# Altium project PCB_Project.PrjPcb (part 2 of 10)
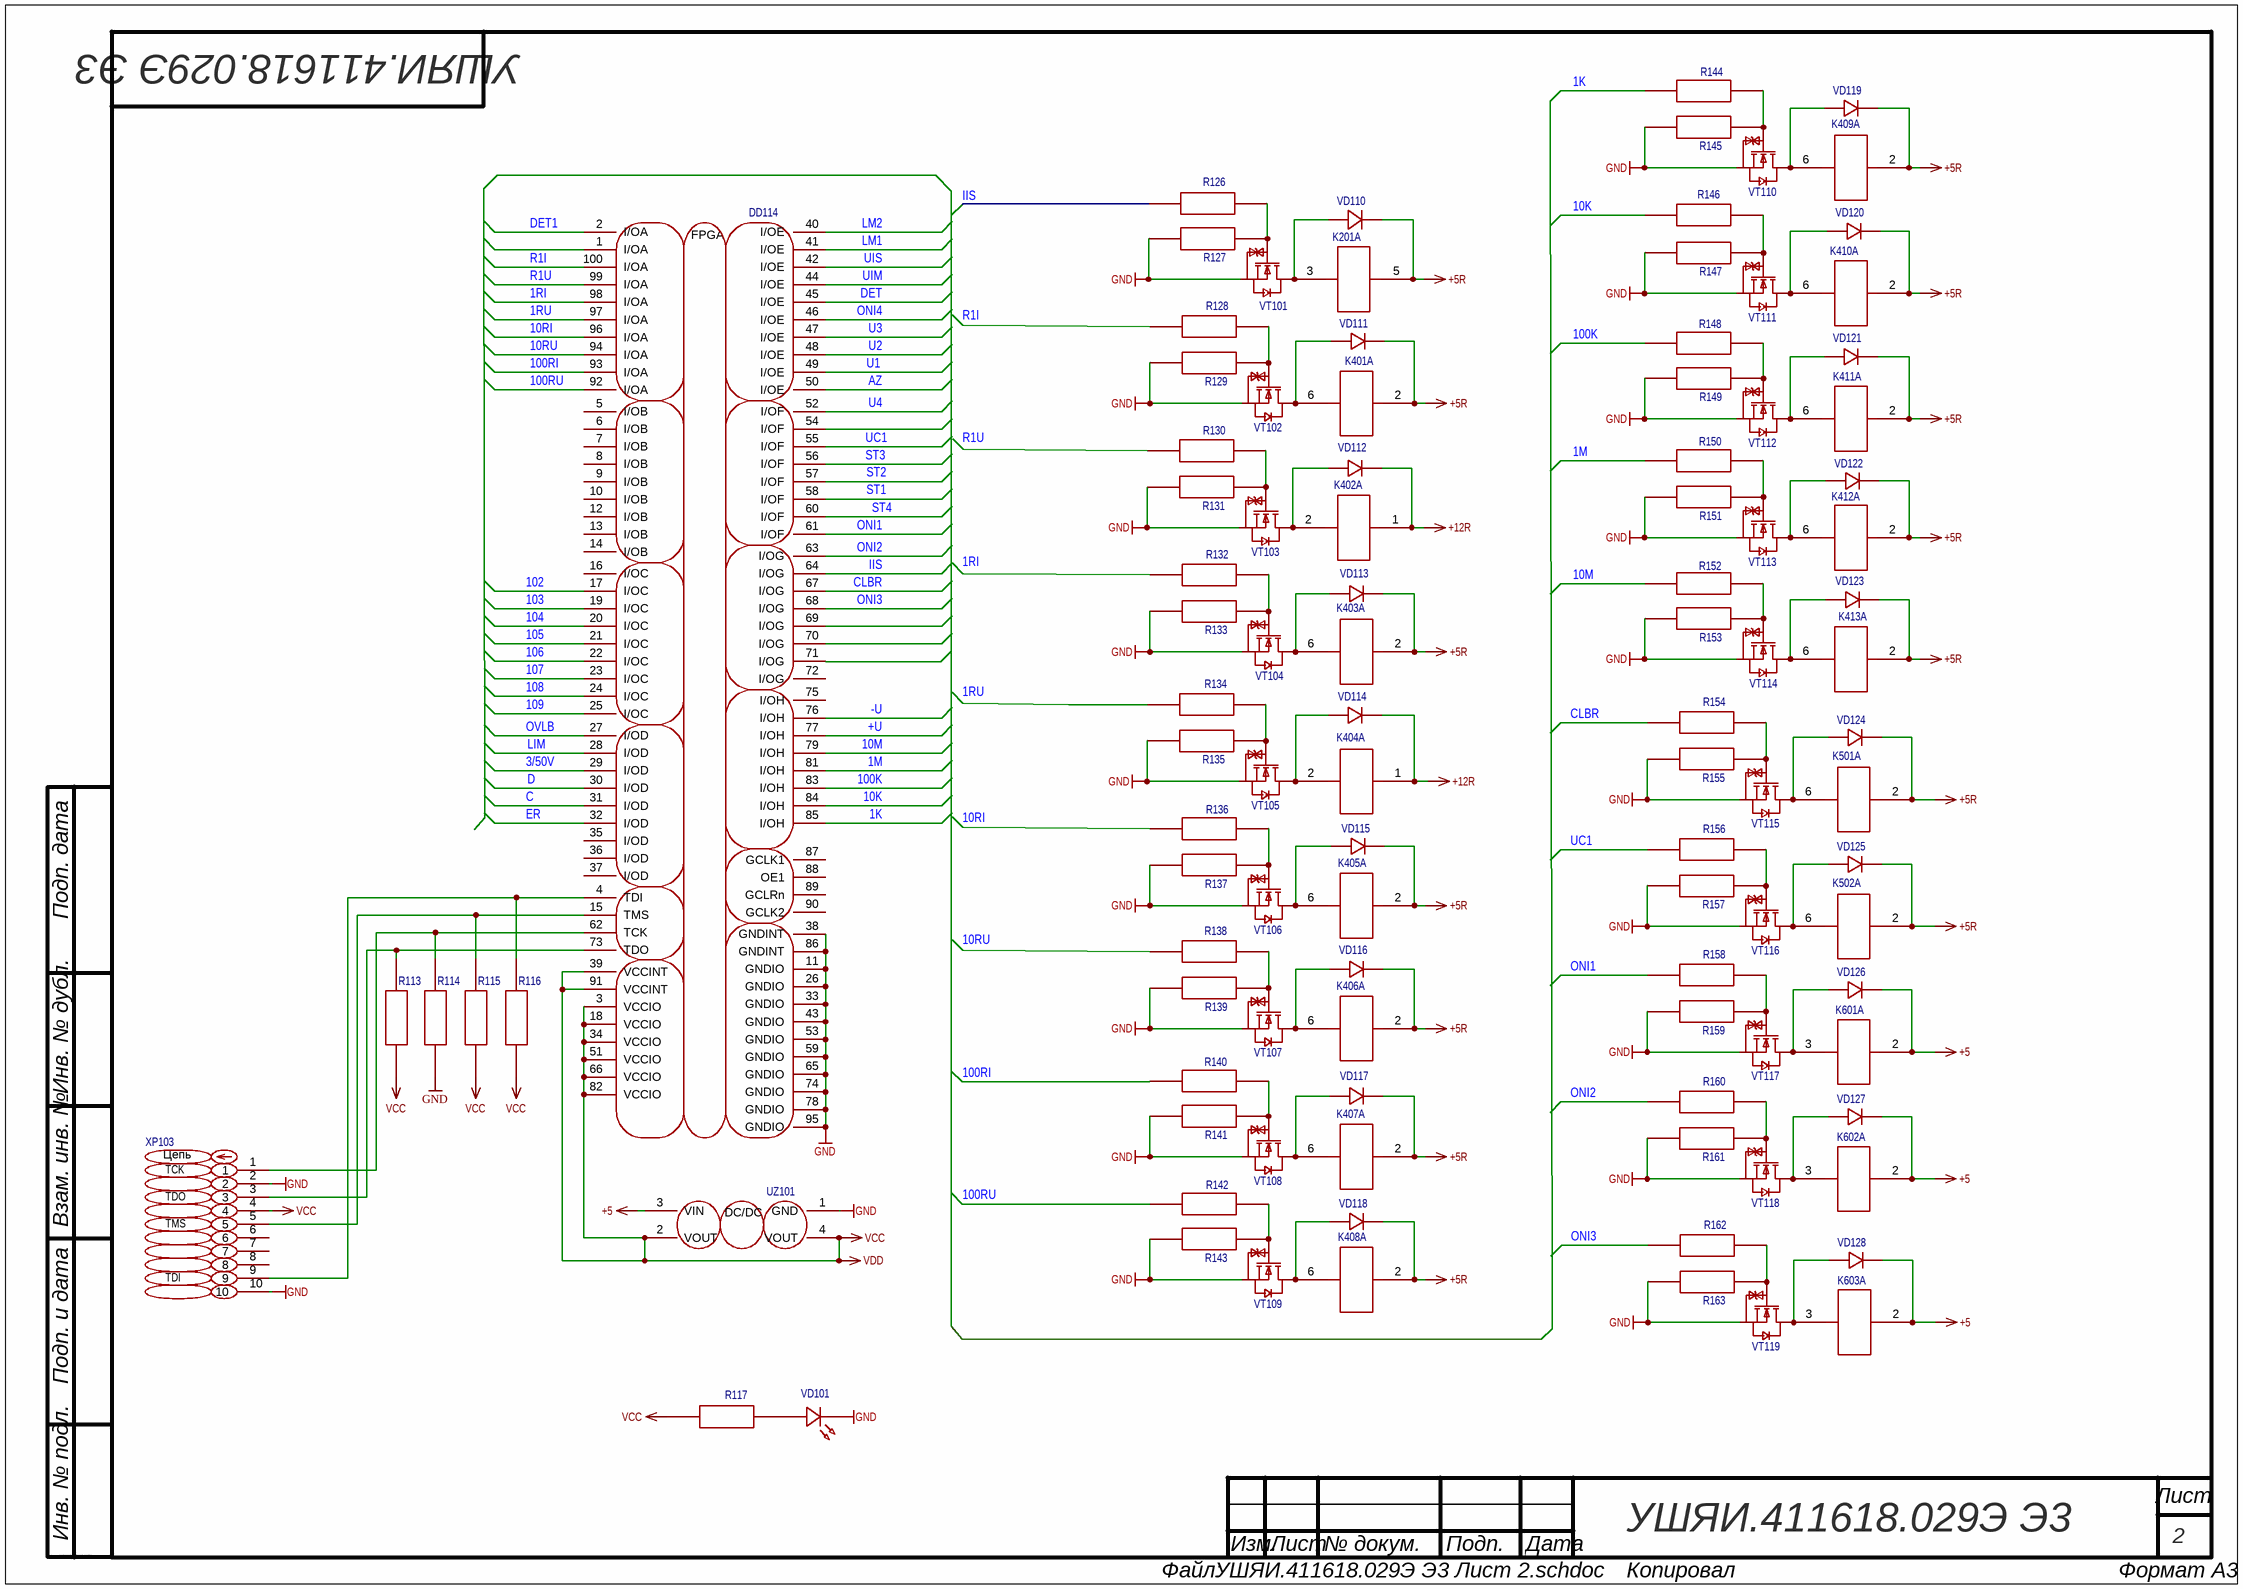
[diagram p7: УШЯИ.411618.029Э Э3 Лист 2.schdoc]

## Sheet УШЯИ.411618.029Э Э3 Лист 2.schdoc (continued)

### Parts
(Parts that share a designator on the sheet are numbered #1, #2 ... from top to bottom, then left to right.)
DD114  ПЛИС EPM3128ATC100-10N [TQFP-100]  [TQFP-100_L14.0-W14.0-P0.50-LS16.0-BL]  (value not drawn)
K201#1  Реле герконовое SIL05-1A72-71L [PCB]  [Реле герконовое DIP05-1C90-51L [PCB]]  (value not drawn)  (part A of 2)
K401  Реле герконовое DIP05-1A72-13L  [PCB]  [RELAY-TH_STANDEXMEDER_DIP05-1A72-13L]  (value not drawn)  (part A of 2)
K402  Реле герконовое УШЯИ.685442.092 (2 реле)  (value not drawn)  (part A of 2)
K403  Реле герконовое DIP05-1A72-13L  [PCB]  [RELAY-TH_STANDEXMEDER_DIP05-1A72-13L]  (value not drawn)  (part A of 2)
K404  Реле герконовое УШЯИ.685442.092 (1 реле)  (value not drawn)  (part A of 2)
K405  Реле герконовое DIP05-1A72-13L  [PCB]  [RELAY-TH_STANDEXMEDER_DIP05-1A72-13L]  (value not drawn)  (part A of 2)
K406  Реле герконовое DIP05-1A72-13L  [PCB]  [RELAY-TH_STANDEXMEDER_DIP05-1A72-13L]  (value not drawn)  (part A of 2)
K407  Реле герконовое DIP05-1A72-13L  [PCB]  [RELAY-TH_STANDEXMEDER_DIP05-1A72-13L]  (value not drawn)  (part A of 2)
K408  Реле герконовое DIP05-1A72-13L  [PCB]  [RELAY-TH_STANDEXMEDER_DIP05-1A72-13L]  (value not drawn)  (part A of 2)
K409  Реле герконовое DIP05-1A72-13L  [PCB]  [RELAY-TH_STANDEXMEDER_DIP05-1A72-13L]  (value not drawn)  (part A of 2)
K410  Реле герконовое DIP05-1A72-13L  [PCB]  [RELAY-TH_STANDEXMEDER_DIP05-1A72-13L]  (value not drawn)  (part A of 2)
K411  Реле герконовое DIP05-1A72-13L  [PCB]  [RELAY-TH_STANDEXMEDER_DIP05-1A72-13L]  (value not drawn)  (part A of 2)
K412  Реле герконовое DIP05-1A72-13L  [PCB]  [RELAY-TH_STANDEXMEDER_DIP05-1A72-13L]  (value not drawn)  (part A of 2)
K413  Реле герконовое DIP05-1A72-13L  [PCB]  [RELAY-TH_STANDEXMEDER_DIP05-1A72-13L]  (value not drawn)  (part A of 2)
K501  Реле герконовое DIP05-1A72-13L  [PCB]  [RELAY-TH_STANDEXMEDER_DIP05-1A72-13L]  (value not drawn)  (part A of 2)
K502  Реле герконовое DIP05-1A72-13L  [PCB]  [RELAY-TH_STANDEXMEDER_DIP05-1A72-13L]  (value not drawn)  (part A of 2)
K601#1  Реле герконовое DIP05-1C90-51L [PCB]  [Реле герконовое DIP05-1A72-13L  [PCB]]  (value not drawn)  (part A of 2)
K602#1  Реле герконовое DIP05-1C90-51L [PCB]  [Реле герконовое DIP05-1A72-13L  [PCB]]  (value not drawn)  (part A of 2)
K603  Реле герконовое DIP05-1C90-51L [PCB]  [Реле герконовое DIP05-1C90-51L [PCB]]  (value not drawn)  (part A of 2)
R113  Резистор 1кОм 0,125Вт 1% [0805]  [R0805]  (value not drawn)
R114  Резистор 1кОм 0,125Вт 1% [0805]  [R0805]  (value not drawn)
R115  Резистор 1кОм 0,125Вт 1% [0805]  [R0805]  (value not drawn)
R116  Резистор 1кОм 0,125Вт 1% [0805]  [R0805]  (value not drawn)
R117  Резистор 100Ом 0,125Вт 1% [0805]  [R0805]  (value not drawn)
R126  Резистор 100Ом 0,125Вт 1% [0805]  [R0805]  (value not drawn)
R127  Резистор 100Ом 0,125Вт 1% [0805]  [R0805]  (value not drawn)
R128  Резистор 100Ом 0,125Вт 1% [0805]  [R0805]  (value not drawn)
R129  Резистор 100Ом 0,125Вт 1% [0805]  [R0805]  (value not drawn)
R130  Резистор 100Ом 0,125Вт 1% [0805]  [R0805]  (value not drawn)
R131  Резистор 100Ом 0,125Вт 1% [0805]  [R0805]  (value not drawn)
R132  Резистор 100Ом 0,125Вт 1% [0805]  [R0805]  (value not drawn)
R133  Резистор 100Ом 0,125Вт 1% [0805]  [R0805]  (value not drawn)
R134  Резистор 100Ом 0,125Вт 1% [0805]  [R0805]  (value not drawn)
R135  Резистор 100Ом 0,125Вт 1% [0805]  [R0805]  (value not drawn)
R136  Резистор 100Ом 0,125Вт 1% [0805]  [R0805]  (value not drawn)
R137  Резистор 100Ом 0,125Вт 1% [0805]  [R0805]  (value not drawn)
R138  Резистор 100Ом 0,125Вт 1% [0805]  [R0805]  (value not drawn)
R139  Резистор 100Ом 0,125Вт 1% [0805]  [R0805]  (value not drawn)
R140  Резистор 100Ом 0,125Вт 1% [0805]  [R0805]  (value not drawn)
R141  Резистор 100Ом 0,125Вт 1% [0805]  [R0805]  (value not drawn)
R142  Резистор 100Ом 0,125Вт 1% [0805]  [R0805]  (value not drawn)
R143  Резистор 100Ом 0,125Вт 1% [0805]  [R0805]  (value not drawn)
R144  Резистор 100Ом 0,125Вт 1% [0805]  [R0805]  (value not drawn)
R145  Резистор 100Ом 0,125Вт 1% [0805]  [R0805]  (value not drawn)
R146  Резистор 100Ом 0,125Вт 1% [0805]  [R0805]  (value not drawn)
R147  Резистор 100Ом 0,125Вт 1% [0805]  [R0805]  (value not drawn)
R148  Резистор 100Ом 0,125Вт 1% [0805]  [R0805]  (value not drawn)
R149  Резистор 100Ом 0,125Вт 1% [0805]  [R0805]  (value not drawn)
R150  Резистор 100Ом 0,125Вт 1% [0805]  [R0805]  (value not drawn)
R151  Резистор 100Ом 0,125Вт 1% [0805]  [R0805]  (value not drawn)
R152  Резистор 100Ом 0,125Вт 1% [0805]  [R0805]  (value not drawn)
R153  Резистор 100Ом 0,125Вт 1% [0805]  [R0805]  (value not drawn)
R154  Резистор 100Ом 0,125Вт 1% [0805]  [R0805]  (value not drawn)
R155  Резистор 100Ом 0,125Вт 1% [0805]  [R0805]  (value not drawn)
R156  Резистор 100Ом 0,125Вт 1% [0805]  [R0805]  (value not drawn)
R157  Резистор 100Ом 0,125Вт 1% [0805]  [R0805]  (value not drawn)
R158  Резистор 100Ом 0,125Вт 1% [0805]  [R0805]  (value not drawn)
R159  Резистор 100Ом 0,125Вт 1% [0805]  [R0805]  (value not drawn)
R160  Резистор 100Ом 0,125Вт 1% [0805]  [R0805]  (value not drawn)
R161  Резистор 100Ом 0,125Вт 1% [0805]  [R0805]  (value not drawn)
R162  Резистор 100Ом 0,125Вт 1% [0805]  [R0805]  (value not drawn)
R163  Резистор 100Ом 0,125Вт 1% [0805]  [R0805]  (value not drawn)
UZ101  Линейный регулятор напряжения LM1117GS-3.3 [SOT-223]  [SOT-223-3_L6.5-W3.4-P2.30-LS7.0-BR]  (value not drawn)
VD101  Светодиод YLED0805YG [0805]  [LED0805-R-RD]  (value not drawn)
VD110  Диод импульсный 1N4448 [SOD-123]  [SOD-123_L2.7-W1.6-LS3.7-RD-1]  (value not drawn)
VD111  Диод импульсный 1N4448 [DO-35]  [DO-35_BD2.0-L4.2-P8.20-D0.5-RD]  (value not drawn)
VD112  Диод импульсный 1N4448 [DO-35]  [DO-35_BD2.0-L4.2-P8.20-D0.5-RD]  (value not drawn)
VD113  Диод импульсный 1N4448 [DO-35]  [DO-35_BD2.0-L4.2-P8.20-D0.5-RD]  (value not drawn)
VD114  Диод импульсный 1N4448 [DO-35]  [DO-35_BD2.0-L4.2-P8.20-D0.5-RD]  (value not drawn)
VD115  Диод импульсный 1N4448 [DO-35]  [DO-35_BD2.0-L4.2-P8.20-D0.5-RD]  (value not drawn)
VD116  Диод импульсный 1N4448 [DO-35]  [DO-35_BD2.0-L4.2-P8.20-D0.5-RD]  (value not drawn)
VD117  Диод импульсный 1N4448 [DO-35]  [DO-35_BD2.0-L4.2-P8.20-D0.5-RD]  (value not drawn)
VD118  Диод импульсный 1N4448 [DO-35]  [DO-35_BD2.0-L4.2-P8.20-D0.5-RD]  (value not drawn)
VD119  Диод импульсный 1N4448 [DO-35]  [DO-35_BD2.0-L4.2-P8.20-D0.5-RD]  (value not drawn)
VD120  Диод импульсный 1N4448 [DO-35]  [DO-35_BD2.0-L4.2-P8.20-D0.5-RD]  (value not drawn)
VD121  Диод импульсный 1N4448 [DO-35]  [DO-35_BD2.0-L4.2-P8.20-D0.5-RD]  (value not drawn)
VD122  Диод импульсный 1N4448 [DO-35]  [DO-35_BD2.0-L4.2-P8.20-D0.5-RD]  (value not drawn)
VD123  Диод импульсный 1N4448 [DO-35]  [DO-35_BD2.0-L4.2-P8.20-D0.5-RD]  (value not drawn)
VD124  Диод импульсный 1N4448 [DO-35]  [DO-35_BD2.0-L4.2-P8.20-D0.5-RD]  (value not drawn)
VD125  Диод импульсный 1N4448 [DO-35]  [DO-35_BD2.0-L4.2-P8.20-D0.5-RD]  (value not drawn)
VD126  Диод импульсный 1N4448 [DO-35]  [DO-35_BD2.0-L4.2-P8.20-D0.5-RD]  (value not drawn)
VD127  Диод импульсный 1N4448 [DO-35]  [DO-35_BD2.0-L4.2-P8.20-D0.5-RD]  (value not drawn)
VD128  Диод импульсный 1N4448 [DO-35]  [DO-35_BD2.0-L4.2-P8.20-D0.5-RD]  (value not drawn)
VT101  Транзистор полевой MOSFET N-канальный BSS138BK [SOT-23-3]  [SOT-23-3_L2.9-W1.3-P1.90-LS2.4-BR]  (value not drawn)
VT102  Транзистор полевой MOSFET N-канальный BSS138BK [SOT-23-3]  [SOT-23-3_L2.9-W1.3-P1.90-LS2.4-BR]  (value not drawn)
VT103  Транзистор полевой MOSFET N-канальный BSS138BK [SOT-23-3]  [SOT-23-3_L2.9-W1.3-P1.90-LS2.4-BR]  (value not drawn)
VT104  Транзистор полевой MOSFET N-канальный BSS138BK [SOT-23-3]  [SOT-23-3_L2.9-W1.3-P1.90-LS2.4-BR]  (value not drawn)
VT105  Транзистор полевой MOSFET N-канальный BSS138BK [SOT-23-3]  [SOT-23-3_L2.9-W1.3-P1.90-LS2.4-BR]  (value not drawn)
VT106  Транзистор полевой MOSFET N-канальный BSS138BK [SOT-23-3]  [SOT-23-3_L2.9-W1.3-P1.90-LS2.4-BR]  (value not drawn)
VT107  Транзистор полевой MOSFET N-канальный BSS138BK [SOT-23-3]  [SOT-23-3_L2.9-W1.3-P1.90-LS2.4-BR]  (value not drawn)
VT108  Транзистор полевой MOSFET N-канальный BSS138BK [SOT-23-3]  [SOT-23-3_L2.9-W1.3-P1.90-LS2.4-BR]  (value not drawn)
VT109  Транзистор полевой MOSFET N-канальный BSS138BK [SOT-23-3]  [SOT-23-3_L2.9-W1.3-P1.90-LS2.4-BR]  (value not drawn)
VT110  Транзистор полевой MOSFET N-канальный BSS138BK [SOT-23-3]  [SOT-23-3_L2.9-W1.3-P1.90-LS2.4-BR]  (value not drawn)
VT111  Транзистор полевой MOSFET N-канальный BSS138BK [SOT-23-3]  [SOT-23-3_L2.9-W1.3-P1.90-LS2.4-BR]  (value not drawn)
VT112  Транзистор полевой MOSFET N-канальный BSS138BK [SOT-23-3]  [SOT-23-3_L2.9-W1.3-P1.90-LS2.4-BR]  (value not drawn)
VT113  Транзистор полевой MOSFET N-канальный BSS138BK [SOT-23-3]  [SOT-23-3_L2.9-W1.3-P1.90-LS2.4-BR]  (value not drawn)
VT114  Транзистор полевой MOSFET N-канальный BSS138BK [SOT-23-3]  [SOT-23-3_L2.9-W1.3-P1.90-LS2.4-BR]  (value not drawn)
VT115  Транзистор полевой MOSFET N-канальный BSS138BK [SOT-23-3]  [SOT-23-3_L2.9-W1.3-P1.90-LS2.4-BR]  (value not drawn)
VT116  Транзистор полевой MOSFET N-канальный BSS138BK [SOT-23-3]  [SOT-23-3_L2.9-W1.3-P1.90-LS2.4-BR]  (value not drawn)
VT117  Транзистор полевой MOSFET N-канальный BSS138BK [SOT-23-3]  [SOT-23-3_L2.9-W1.3-P1.90-LS2.4-BR]  (value not drawn)
VT118  Транзистор полевой MOSFET N-канальный BSS138BK [SOT-23-3]  [SOT-23-3_L2.9-W1.3-P1.90-LS2.4-BR]  (value not drawn)
VT119  Транзистор полевой MOSFET N-канальный BSS138BK [SOT-23-3]  [SOT-23-3_L2.9-W1.3-P1.90-LS2.4-BR]  (value not drawn)
XP103  Вилка на плату прямая BH-10 (DS1013-10S) 10pin шаг 2.54мм  [IDC-TH_10P-P2.54-V-R2-C5-S2.54]  (value not drawn)

### Nets
+5: K601#1.2 K602#1.2 K603.2 UZ101.3(VIN) VD126.1 VD127.1 VD128.1
+5R: K201#1.5 K401.2 K403.2 K405.2 K406.2 K407.2 K408.2 K409.2 K410.2 K411.2 K412.2 K413.2 K501.2 K502.2 VD110.1(C) VD111.1 VD113.1 VD115.1 VD116.1 VD117.1 VD118.1 VD119.1 VD120.1 VD121.1 VD122.1 VD123.1 VD124.1 VD125.1
+12R: K402.1 K404.1 VD112.1 VD114.1
GND: DD114.11(GNDIO) DD114.26(GNDIO) DD114.33(GNDIO) DD114.38(GNDINT) DD114.43(GNDIO) DD114.53(GNDIO) DD114.59(GNDIO) DD114.65(GNDIO) DD114.74(GNDIO) DD114.78(GNDIO) DD114.86(GNDINT) DD114.95(GNDIO) R114.1 R127.1 R129.1 R131.1 R133.1 R135.1 R137.1 R139.1 R141.1 R143.1 R145.1 R147.1 R149.1 R151.1 R153.1 R155.1 R157.1 R159.1 R161.1 R163.1 UZ101.1(GND) VD101.2 VT101.2(S) VT102.2(S) VT103.2(S) VT104.2(S) VT105.2(S) VT106.2(S) VT107.2(S) VT108.2(S) VT109.2(S) VT110.2(S) VT111.2(S) VT112.2(S) VT113.2(S) VT114.2(S) VT115.2(S) VT116.2(S) VT117.2(S) VT118.2(S) VT119.2(S) XP103.2 XP103.10
VDD: DD114.3(VCCIO) DD114.18(VCCIO) DD114.34(VCCIO) DD114.39(VCCINT) DD114.51(VCCIO) DD114.66(VCCIO) DD114.82(VCCIO) DD114.91(VCCINT) R113.1 R115.1 R116.1 R117.1 UZ101.2(VOUT) UZ101.4(VOUT) XP103.4  [also labelled VCC]
1K: DD114.85(I/OH) R144.1
1M: DD114.81(I/OH) R150.1
1RI: DD114.98(I/OA)
1RU: DD114.97(I/OA)
3/50V: DD114.29(I/OD)
10K: DD114.84(I/OH) R146.1
10M: DD114.79(I/OH) R152.1
10RI: DD114.96(I/OA)
10RU: DD114.94(I/OA)
100K: DD114.83(I/OH) R148.1
100RI: DD114.93(I/OA) R140.1
100RU: DD114.92(I/OA) R142.1
102: DD114.17(I/OC)
103: DD114.19(I/OC)
104: DD114.20(I/OC)
105: DD114.21(I/OC)
106: DD114.22(I/OC)
107: DD114.23(I/OC)
108: DD114.24(I/OC)
109: DD114.25(I/OC)
+U: DD114.77(I/OH)
-U: DD114.76(I/OH)
AZ: DD114.50(I/OE)
C: DD114.31(I/OD)
CLBR: DD114.67(I/OG) R154.1
D: DD114.30(I/OD)
DET: DD114.45(I/OE)
DET1: DD114.2(I/OA)
ER: DD114.32(I/OD)
IIS: DD114.64(I/OG) R126.1
LIM: DD114.28(I/OD)
LM1: DD114.41(I/OE)
LM2: DD114.40(I/OE)
ONI1: DD114.61(I/OF) R158.1
ONI2: DD114.63(I/OG) R160.1
ONI3: DD114.68(I/OG) R162.1
ONI4: DD114.46(I/OE)
OVLB: DD114.27(I/OD)
R1I: DD114.100(I/OA)
R1U: DD114.99(I/OA)
ST1: DD114.58(I/OF)
ST2: DD114.57(I/OF)
ST3: DD114.56(I/OF)
ST4: DD114.60(I/OF)
U1: DD114.49(I/OE)
U2: DD114.48(I/OE)
U3: DD114.47(I/OE)
U4: DD114.52(I/OF)
UC1: DD114.55(I/OF) R156.1
UIM: DD114.44(I/OE)
UIS: DD114.42(I/OE)
NetDD114_4: DD114.4(TDI) R116.2 XP103.9
NetDD114_15: DD114.15(TMS) R115.2 XP103.5
NetDD114_62: DD114.62(TCK) R114.2 XP103.1
NetDD114_73: DD114.73(TDO) R113.2 XP103.3
NetK201#1_3: K201#1.3 VD110.2(A) VT101.3(D)
NetK401_6: K401.6 VD111.2 VT102.3(D)
NetK402_2: K402.2 VD112.2 VT103.3(D)
NetK403_6: K403.6 VD113.2 VT104.3(D)
NetK404_2: K404.2 VD114.2 VT105.3(D)
NetK405_6: K405.6 VD115.2 VT106.3(D)
NetK406_6: K406.6 VD116.2 VT107.3(D)
NetK407_6: K407.6 VD117.2 VT108.3(D)
NetK408_6: K408.6 VD118.2 VT109.3(D)
NetK409_6: K409.6 VD119.2 VT110.3(D)
NetK410_6: K410.6 VD120.2 VT111.3(D)
NetK411_6: K411.6 VD121.2 VT112.3(D)
NetK412_6: K412.6 VD122.2 VT113.3(D)
NetK413_6: K413.6 VD123.2 VT114.3(D)
NetK501_6: K501.6 VD124.2 VT115.3(D)
NetK502_6: K502.6 VD125.2 VT116.3(D)
NetK601#1_3: K601#1.3 VD126.2 VT117.3(D)
NetK602#1_3: K602#1.3 VD127.2 VT118.3(D)
NetK603_3: K603.3 VD128.2 VT119.3(D)
NetR117_2: R117.2 VD101.1
NetR126_2: R126.2 R127.2 VT101.1(G)
NetR128_2: R128.2 R129.2 VT102.1(G)
NetR130_2: R130.2 R131.2 VT103.1(G)
NetR132_2: R132.2 R133.2 VT104.1(G)
NetR134_2: R134.2 R135.2 VT105.1(G)
NetR136_2: R136.2 R137.2 VT106.1(G)
NetR138_2: R138.2 R139.2 VT107.1(G)
NetR140_2: R140.2 R141.2 VT108.1(G)
NetR142_2: R142.2 R143.2 VT109.1(G)
NetR144_2: R144.2 R145.2 VT110.1(G)
NetR146_2: R146.2 R147.2 VT111.1(G)
NetR148_2: R148.2 R149.2 VT112.1(G)
NetR150_2: R150.2 R151.2 VT113.1(G)
NetR152_2: R152.2 R153.2 VT114.1(G)
NetR154_2: R154.2 R155.2 VT115.1(G)
NetR156_2: R156.2 R157.2 VT116.1(G)
NetR158_2: R158.2 R159.2 VT117.1(G)
NetR160_2: R160.2 R161.2 VT118.1(G)
NetR162_2: R162.2 R163.2 VT119.1(G)

Not connected (* = marked no-connect by the designer): DD114 1(I/OA) 5(I/OB) 6(I/OB) 7(I/OB) 8(I/OB) 9(I/OB) 10(I/OB) 12(I/OB) 13(I/OB) 14(I/OB) 16(I/OC) 35(I/OD) 36(I/OD) 37(I/OD) 54(I/OF) 69(I/OG) 70(I/OG) 71(I/OG) 72(I/OG) 75(I/OH) 87(GCLK1) 88(OE1) 89(GCLRn) 90(GCLK2); R128 1; R130 1; R132 1; R134 1; R136 1; R138 1; XP103 6 7 8

### Notes on the sheet
- (near XP103) TCK
- (near XP103) TDO
- (near XP103) TMS
- (near XP103) TDI
- Labels drawn without touching a wire or pin: 1RI, 1RU, 10RI, 10RU, R1I, R1U
- Подп. дата
- Инв. № дубл.
- Взам. инв. №
- Подп. и дата
- Инв. № подл.
- Изм.
- Лист
- № докум.
- Подп.
- Дата
- ALTIUM GOSTBOM2.0 KEV
- Файл:
- Копировал
- Формат А3
- (in symbol Вилка на плату прямая BH-10 (DS1013-10S) 10pin шаг 2.54мм) Цепь
- (in symbol Линейный регулятор напряжения LM1117GS-3.3 [SOT-223]) DC/DC
- (in symbol ПЛИС EPM3128ATC100-10N [TQFP-100]) FPGA